# EAGLE schematic SNES_RGBAmp (EAGLE 7.6.0)
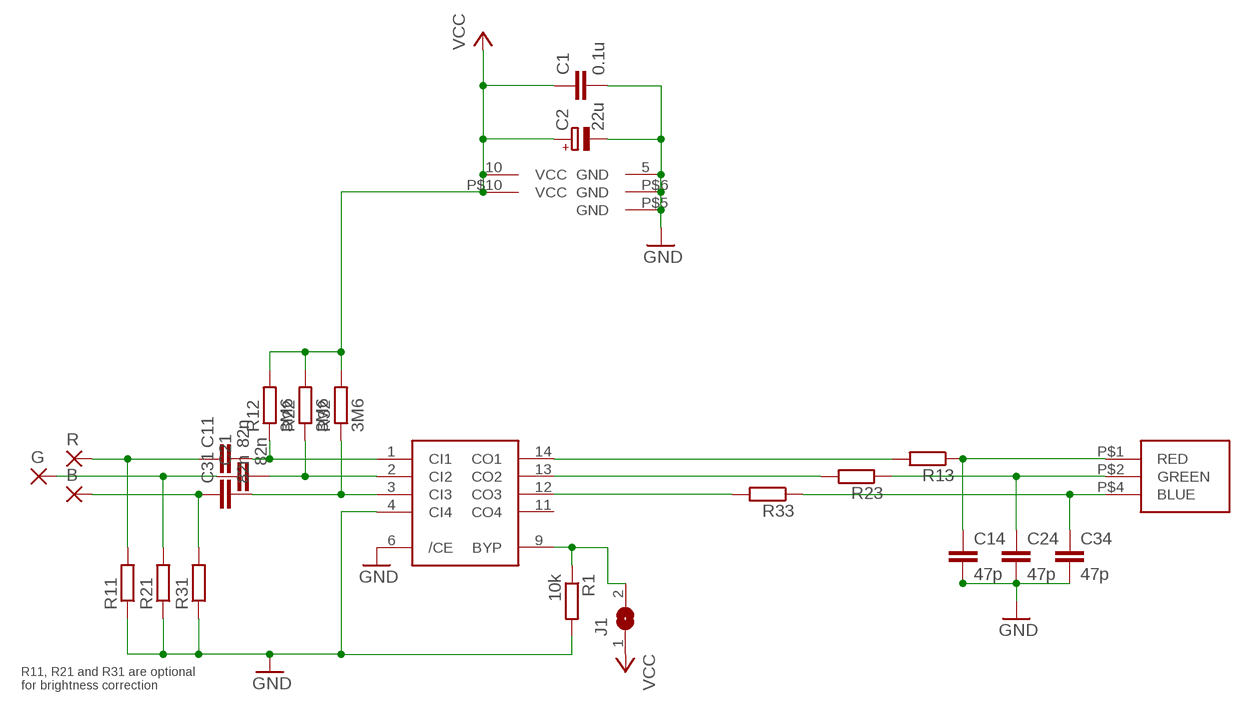
[diagram p0: schematic, sheet 1]

## Parts
B  SMD2  [SMD1,27-2,54]
C1  0.1u  C-EUC0603K  [C0603K]
C2  22u  CPOL-EUSMCB  [SMC_B]
C11  82n  C-EUC0603K  [C0603K]
C14  47p  C-EUC0603K  [C0603K]
C21  82n  C-EUC0603K  [C0603K]
C24  47p  C-EUC0603K  [C0603K]
C31  82n  C-EUC0603K  [C0603K]
C34  47p  C-EUC0603K  [C0603K]
G  SMD2  [SMD1,27-2,54]
J1  SJ  [SJ]
R  SMD2  [SMD1,27-2,54]
R1  10k  R-EU_R0603  [R0603]
R11  R-EU_R0603  [R0603]
R12  3M6  R-EU_R0603  [R0603]
R13  R-EU_R0603  [R0603]
R21  R-EU_R0603  [R0603]
R22  3M6  R-EU_R0603  [R0603]
R23  R-EU_R0603  [R0603]
R31  R-EU_R0603  [R0603]
R32  3M6  R-EU_R0603  [R0603]
R33  R-EU_R0603  [R0603]
U1  THS7374  [THS7374]
U$1  SNES_MULTIAV_RGB_ONLY  [SNES_MULTIAV_RGB_ONLY]

## Nets
GND: C1.2 C2.- C14.2 C24.2 C34.2 R1.2 R11.1 R21.1 R31.1 U1.4(CI4) U1.5(GND) U1.6(/CE) U$1.P$5(GND) U$1.P$6(GND)
N$1: C11.2 R12.1 U1.1(CI1)
N$2: C21.2 R22.1 U1.2(CI2)
N$3: J1.2 R1.1 U1.9(BYP)
N$5: C14.1 R13.1 U$1.P$1(RED)
N$6: C24.1 R23.1 U$1.P$2(GREEN)
N$8: R33.2 U1.12(CO3)
N$9: C34.1 R33.1 U$1.P$4(BLUE)
N$12: R13.2 U1.14(CO1)
N$13: R23.2 U1.13(CO2)
N$14: C11.1 R11.2 R.1(P)
N$15: C21.1 G.1(P) R21.2
N$16: B.1(P) C31.1 R31.2
R9: C31.2 R32.1 U1.3(CI3)
VCC: C1.1 C2.+ J1.1 R12.2 R22.2 R32.2 U1.10(VCC) U$1.P$10(VCC)
Unconnected: U1.11(CO4)

## Notes on the sheet
- R11, R21 and R31 are optional
  for brightness correction

## Library data of the parts
B G R = wirepad:SMD2: SMD PAD
C1 C11 C14 C21 C24 C31 C34 = rcl:C-EU: CAPACITOR, European symbol
C2 = rcl:CPOL-EU: POLARIZED CAPACITOR, European symbol
J1 = jumper:SJ: SMD solder JUMPER
R1 R11-R13 R21-R23 R31-R33 = rcl:R-EU_: RESISTOR, European symbol
U1 = snes_div:THS7374
U$1 = snes_div:SNES_MULTIAV_RGB_ONLY